# Altium schematic sheet ControlBoard_Top.SchDoc
size A
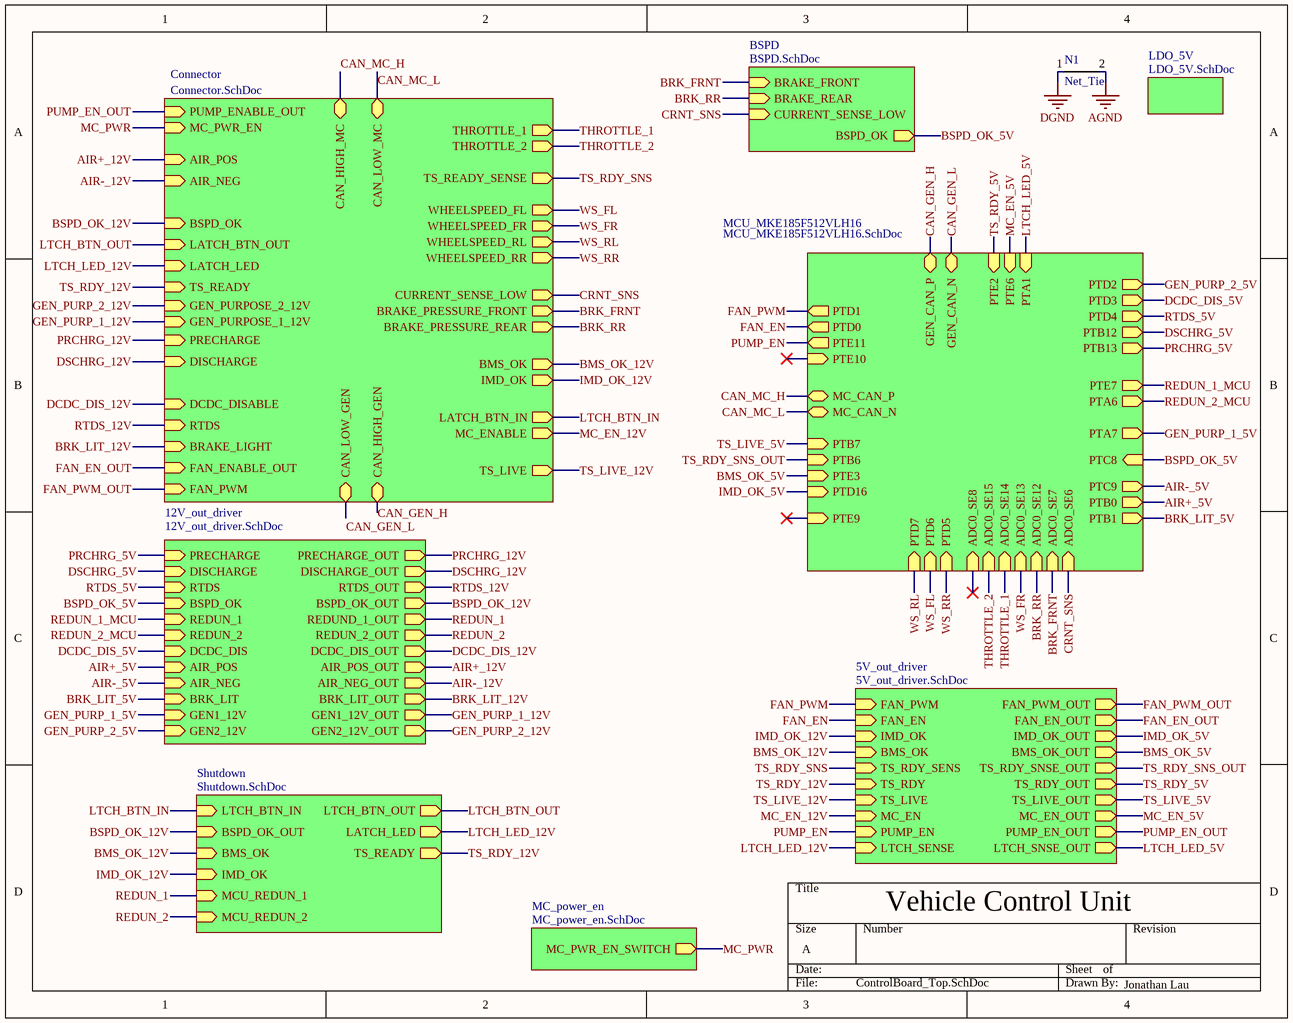
[diagram p0: ControlBoard_Top.SchDoc]

## Parts
N1  Net_Tie  [Net_Tie]

## Sub-sheets
5V_out_driver = 5V_out_driver.SchDoc: FAN_PWM (in), IMD_OK (in), IMD_OK_OUT (out), MC_EN_OUT (out), TS_LIVE_OUT (out), FAN_PWM_OUT (out), BMS_OK (in), MC_EN (in), TS_LIVE (in), BMS_OK_OUT (out), TS_RDY_OUT (out), FAN_EN_OUT (out), TS_RDY (in), TS_RDY_SENS (in), FAN_EN (in), TS_RDY_SNSE_OUT (out), PUMP_EN_OUT (out), PUMP_EN (in), LTCH_SENSE (in), LTCH_SNSE_OUT (out)
12V_out_driver = 12V_out_driver.SchDoc: PRECHARGE (in), DISCHARGE (in), RTDS (in), BSPD_OK (in), RTDS_OUT (out), PRECHARGE_OUT (out), DISCHARGE_OUT (out), BSPD_OK_OUT (out), REDUN_1 (in), REDUN_2 (in), REDUND_1_OUT (out), REDUN_2_OUT (out), DCDC_DIS_OUT (out), DCDC_DIS (in), BRK_LIT (in), BRK_LIT_OUT (out), GEN2_12V_OUT (out), GEN2_12V (in), GEN1_12V (in), GEN1_12V_OUT (out), AIR_NEG_OUT (out), AIR_POS (in), AIR_NEG (in), AIR_POS_OUT (out)
BSPD = BSPD.SchDoc: BRAKE_FRONT (in), BRAKE_REAR (in), CURRENT_SENSE_LOW (in), BSPD_OK (out)
Connector = Connector.SchDoc: PUMP_ENABLE_OUT (in), MC_PWR_EN (in), THROTTLE_1 (out), WHEELSPEED_RL (out), CURRENT_SENSE_LOW (out), DISCHARGE (in), RTDS (in), WHEELSPEED_FL (out), FAN_ENABLE_OUT (in), MC_ENABLE (out), PRECHARGE (in), CAN_HIGH_GEN (bidir), CAN_LOW_GEN (bidir), BSPD_OK (in), TS_READY_SENSE (out), TS_READY (in), FAN_PWM (in), LATCH_BTN_IN (out), BRAKE_PRESSURE_REAR (out), LATCH_BTN_OUT (in), LATCH_LED (in), WHEELSPEED_FR (out), DCDC_DISABLE (in), BRAKE_LIGHT (in), CAN_LOW_MC (bidir), WHEELSPEED_RR (out), CAN_HIGH_MC (bidir), IMD_OK (out), THROTTLE_2 (out), BRAKE_PRESSURE_FRONT (out), BMS_OK (out), TS_LIVE (out), GEN_PURPOSE_2_12V (in), GEN_PURPOSE_1_12V (in), AIR_NEG (in), AIR_POS (in)
LDO_5V = LDO_5V.SchDoc: no entries
MC_power_en = MC_power_en.SchDoc: MC_PWR_EN_SWITCH (out)
MCU_MKE185F512VLH16 = MCU_MKE185F512VLH16.SchDoc: ADC0_SE6 (in), PTA6 (out), PTD3 (out), PTA1 (in), PTD1 (out), PTB12 (out), PTB13 (out), PTE7 (out), PTB7 (in), PTB6 (in), PTD16 (in), PTE2 (in), PTD4 (out), PTD0 (out), ADC0_SE7 (in), ADC0_SE12 (in), ADC0_SE13 (in), ADC0_SE14 (in), ADC0_SE15 (in), ADC0_SE8 (in), PTE3 (in), PTB0 (out), PTE6 (in), PTD5 (in), PTE9 (in), PTE10 (in), PTE11 (out), PTD6 (in), PTD7 (in), GEN_CAN_P (bidir), MC_CAN_P (bidir), GEN_CAN_N (bidir), MC_CAN_N (bidir), PTC9 (out), PTB1 (out), PTC8 (in), PTA7 (out), PTD2 (out)
Shutdown = Shutdown.SchDoc: BSPD_OK_OUT (in), TS_READY (out), LATCH_LED (out), IMD_OK (in), BMS_OK (in), LTCH_BTN_OUT (out), LTCH_BTN_IN (in), MCU_REDUN_2 (in), MCU_REDUN_1 (in)

## Nets
AGND: N1.2
DGND: N1.1
AIR+_5V: sheet 12V_out_driver/AIR_POS, sheet MCU_MKE185F512VLH16/PTB0
AIR+_12V: sheet 12V_out_driver/AIR_POS_OUT, sheet Connector/AIR_POS
AIR-_5V: sheet 12V_out_driver/AIR_NEG, sheet MCU_MKE185F512VLH16/PTC9
AIR-_12V: sheet 12V_out_driver/AIR_NEG_OUT, sheet Connector/AIR_NEG
BMS_OK_5V: sheet 5V_out_driver/BMS_OK_OUT, sheet MCU_MKE185F512VLH16/PTE3
BMS_OK_12V: sheet 5V_out_driver/BMS_OK, sheet Connector/BMS_OK, sheet Shutdown/BMS_OK
BRK_FRNT: sheet Connector/BRAKE_PRESSURE_FRONT, sheet BSPD/BRAKE_FRONT, sheet MCU_MKE185F512VLH16/ADC0_SE7
BRK_LIT_5V: sheet 12V_out_driver/BRK_LIT, sheet MCU_MKE185F512VLH16/PTB1
BRK_LIT_12V: sheet 12V_out_driver/BRK_LIT_OUT, sheet Connector/BRAKE_LIGHT
BRK_RR: sheet Connector/BRAKE_PRESSURE_REAR, sheet BSPD/BRAKE_REAR, sheet MCU_MKE185F512VLH16/ADC0_SE12
BSPD_OK_5V: sheet 12V_out_driver/BSPD_OK, sheet BSPD/BSPD_OK, sheet MCU_MKE185F512VLH16/PTC8
BSPD_OK_12V: sheet 12V_out_driver/BSPD_OK_OUT, sheet Connector/BSPD_OK, sheet Shutdown/BSPD_OK_OUT
CAN_GEN_H: sheet Connector/CAN_HIGH_GEN, sheet MCU_MKE185F512VLH16/GEN_CAN_P
CAN_GEN_L: sheet Connector/CAN_LOW_GEN, sheet MCU_MKE185F512VLH16/GEN_CAN_N
CAN_MC_H: sheet Connector/CAN_HIGH_MC, sheet MCU_MKE185F512VLH16/MC_CAN_P
CAN_MC_L: sheet Connector/CAN_LOW_MC, sheet MCU_MKE185F512VLH16/MC_CAN_N
CRNT_SNS: sheet Connector/CURRENT_SENSE_LOW, sheet BSPD/CURRENT_SENSE_LOW, sheet MCU_MKE185F512VLH16/ADC0_SE6
DCDC_DIS_5V: sheet 12V_out_driver/DCDC_DIS, sheet MCU_MKE185F512VLH16/PTD3
DCDC_DIS_12V: sheet 12V_out_driver/DCDC_DIS_OUT, sheet Connector/DCDC_DISABLE
DSCHRG_5V: sheet 12V_out_driver/DISCHARGE, sheet MCU_MKE185F512VLH16/PTB12
DSCHRG_12V: sheet 12V_out_driver/DISCHARGE_OUT, sheet Connector/DISCHARGE
FAN_EN: sheet 5V_out_driver/FAN_EN, sheet MCU_MKE185F512VLH16/PTD0
FAN_EN_OUT: sheet 5V_out_driver/FAN_EN_OUT, sheet Connector/FAN_ENABLE_OUT
FAN_PWM: sheet 5V_out_driver/FAN_PWM, sheet MCU_MKE185F512VLH16/PTD1
FAN_PWM_OUT: sheet 5V_out_driver/FAN_PWM_OUT, sheet Connector/FAN_PWM
GEN_PURP_1_5V: sheet 12V_out_driver/GEN1_12V, sheet MCU_MKE185F512VLH16/PTA7
GEN_PURP_1_12V: sheet 12V_out_driver/GEN1_12V_OUT, sheet Connector/GEN_PURPOSE_1_12V
GEN_PURP_2_5V: sheet 12V_out_driver/GEN2_12V, sheet MCU_MKE185F512VLH16/PTD2
GEN_PURP_2_12V: sheet 12V_out_driver/GEN2_12V_OUT, sheet Connector/GEN_PURPOSE_2_12V
IMD_OK_5V: sheet 5V_out_driver/IMD_OK_OUT, sheet MCU_MKE185F512VLH16/PTD16
IMD_OK_12V: sheet 5V_out_driver/IMD_OK, sheet Connector/IMD_OK, sheet Shutdown/IMD_OK
LTCH_BTN_IN: sheet Connector/LATCH_BTN_IN, sheet Shutdown/LTCH_BTN_IN
LTCH_BTN_OUT: sheet Connector/LATCH_BTN_OUT, sheet Shutdown/LTCH_BTN_OUT
LTCH_LED_5V: sheet 5V_out_driver/LTCH_SNSE_OUT, sheet MCU_MKE185F512VLH16/PTA1
LTCH_LED_12V: sheet 5V_out_driver/LTCH_SENSE, sheet Connector/LATCH_LED, sheet Shutdown/LATCH_LED
MC_EN_5V: sheet 5V_out_driver/MC_EN_OUT, sheet MCU_MKE185F512VLH16/PTE6
MC_EN_12V: sheet 5V_out_driver/MC_EN, sheet Connector/MC_ENABLE
MC_PWR: sheet Connector/MC_PWR_EN, sheet MC_power_en/MC_PWR_EN_SWITCH
PRCHRG_5V: sheet 12V_out_driver/PRECHARGE, sheet MCU_MKE185F512VLH16/PTB13
PRCHRG_12V: sheet 12V_out_driver/PRECHARGE_OUT, sheet Connector/PRECHARGE
PUMP_EN: sheet 5V_out_driver/PUMP_EN, sheet MCU_MKE185F512VLH16/PTE11
PUMP_EN_OUT: sheet 5V_out_driver/PUMP_EN_OUT, sheet Connector/PUMP_ENABLE_OUT
REDUN_1: sheet 12V_out_driver/REDUND_1_OUT, sheet Shutdown/MCU_REDUN_1
REDUN_1_MCU: sheet 12V_out_driver/REDUN_1, sheet MCU_MKE185F512VLH16/PTE7
REDUN_2: sheet 12V_out_driver/REDUN_2_OUT, sheet Shutdown/MCU_REDUN_2
REDUN_2_MCU: sheet 12V_out_driver/REDUN_2, sheet MCU_MKE185F512VLH16/PTA6
RTDS_5V: sheet 12V_out_driver/RTDS, sheet MCU_MKE185F512VLH16/PTD4
RTDS_12V: sheet 12V_out_driver/RTDS_OUT, sheet Connector/RTDS
THROTTLE_1: sheet Connector/THROTTLE_1, sheet MCU_MKE185F512VLH16/ADC0_SE14
THROTTLE_2: sheet Connector/THROTTLE_2, sheet MCU_MKE185F512VLH16/ADC0_SE15
TS_LIVE_5V: sheet 5V_out_driver/TS_LIVE_OUT, sheet MCU_MKE185F512VLH16/PTB7
TS_LIVE_12V: sheet 5V_out_driver/TS_LIVE, sheet Connector/TS_LIVE
TS_RDY_5V: sheet 5V_out_driver/TS_RDY_OUT, sheet MCU_MKE185F512VLH16/PTE2
TS_RDY_12V: sheet 5V_out_driver/TS_RDY, sheet Connector/TS_READY, sheet Shutdown/TS_READY
TS_RDY_SNS: sheet 5V_out_driver/TS_RDY_SENS, sheet Connector/TS_READY_SENSE
TS_RDY_SNS_OUT: sheet 5V_out_driver/TS_RDY_SNSE_OUT, sheet MCU_MKE185F512VLH16/PTB6
WS_FL: sheet Connector/WHEELSPEED_FL, sheet MCU_MKE185F512VLH16/PTD6
WS_FR: sheet Connector/WHEELSPEED_FR, sheet MCU_MKE185F512VLH16/ADC0_SE13
WS_RL: sheet Connector/WHEELSPEED_RL, sheet MCU_MKE185F512VLH16/PTD7
WS_RR: sheet Connector/WHEELSPEED_RR, sheet MCU_MKE185F512VLH16/PTD5

## Notes on the sheet
- Vehicle Control Unit
- Jonathan Lau

## Library data of the parts
N1 = 1: Manufacturer_id: 1; idFuse: 3; Name: Net Tie; Drawer_id: 1; idShunt: 1